# EAGLE schematic Control_Board_Schematic_v5 (EAGLE 9.7.0)
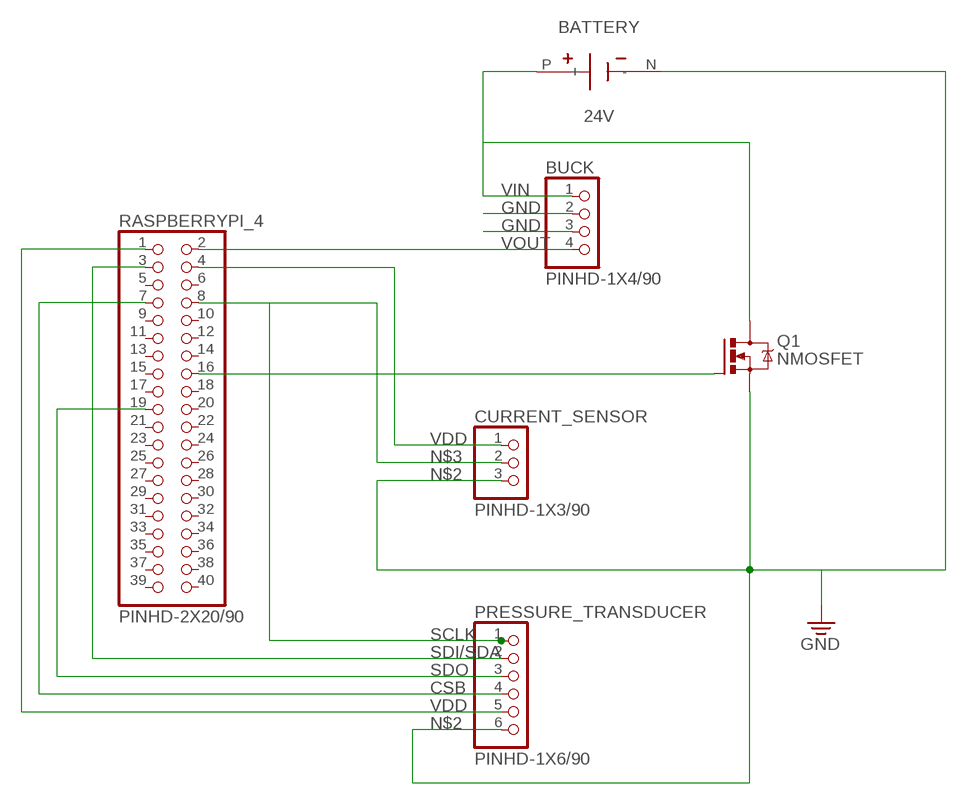
[diagram p0: schematic, sheet 1]

## Parts
BATTERY  24V  796136-1  [796136-1]
BUCK  PINHD-1X4/90  [1X04/90]
CURRENT_SENSOR  PINHD-1X3/90  [1X03/90]
PRESSURE_TRANSDUCER  PINHD-1X6/90  [1X06/90]
Q1  NMOSFET  NMOSFET_TO220  [TO220BV]
RASPBERRYPI_4  PINHD-2X20/90  [2X20/90]

## Nets
CSB: PRESSURE_TRANSDUCER.4 RASPBERRYPI_4.7
GND: BUCK.2 BUCK.3
N$1: Q1.G RASPBERRYPI_4.16
N$2: BATTERY.N(-) CURRENT_SENSOR.3 PRESSURE_TRANSDUCER.6 Q1.S
N$3: CURRENT_SENSOR.2 RASPBERRYPI_4.8
SCLK: PRESSURE_TRANSDUCER.1
SDI/SDA: PRESSURE_TRANSDUCER.2 RASPBERRYPI_4.3
SDO: PRESSURE_TRANSDUCER.3 RASPBERRYPI_4.19
VDD: CURRENT_SENSOR.1 PRESSURE_TRANSDUCER.5 RASPBERRYPI_4.1 RASPBERRYPI_4.4
VIN: BATTERY.P(+) BUCK.1 Q1.D
VOUT: BUCK.4 RASPBERRYPI_4.2
Unconnected: RASPBERRYPI_4.5 RASPBERRYPI_4.6 RASPBERRYPI_4.9 RASPBERRYPI_4.10 RASPBERRYPI_4.11 RASPBERRYPI_4.12 RASPBERRYPI_4.13 RASPBERRYPI_4.14 RASPBERRYPI_4.15 RASPBERRYPI_4.17 RASPBERRYPI_4.18 RASPBERRYPI_4.20 RASPBERRYPI_4.21 RASPBERRYPI_4.22 RASPBERRYPI_4.23 RASPBERRYPI_4.24 RASPBERRYPI_4.25 RASPBERRYPI_4.26 RASPBERRYPI_4.27 RASPBERRYPI_4.28 RASPBERRYPI_4.29 RASPBERRYPI_4.30 RASPBERRYPI_4.31 RASPBERRYPI_4.32 RASPBERRYPI_4.33 RASPBERRYPI_4.34 RASPBERRYPI_4.35 RASPBERRYPI_4.36 RASPBERRYPI_4.37 RASPBERRYPI_4.38 RASPBERRYPI_4.39 RASPBERRYPI_4.40

## Library data of the parts
BATTERY = Battery_Holder:796136-1: Battery Holder - Coin Cell SMD, 20.0mm Datasheet <https://www.te.com/commerce/DocumentDelivery/DDEController?Action=showdoc&DocId=Customer+Drawing%7F796136%7FG5%7Fpdf%7FEnglish%7FENG_CD_796136_G5.pdf%7F796136-1>; CATEGORY: Battery-Holder; MANUFACTURER: TE Connectivity AMP Connectors; MPN: 796136-1; PART_STATUS: ACTIVE; ROHS_COMPLIANCE: Compliant; SERIES: 2032; SUB_CATEGORY: Holder; TYPE: Coin Cell; VALUE: 796136-1
BUCK = Connector:PINHD-1X4: PIN HEADER; CATEGORY: CONNECTOR; SUB-CATEGORY: PIN-HEADER
CURRENT_SENSOR = Connector:PINHD-1X3: PIN HEADER; CATEGORY: CONNECTOR; SUB-CATEGORY: PIN-HEADER
PRESSURE_TRANSDUCER = Connector:PINHD-1X6: PIN HEADER; CATEGORY: CONNECTOR; SUB-CATEGORY: PIN-HEADER
Q1 = Transistor:NMOSFET: N-Channel MOSFET - Generic; CATEGORY: Transistor; SUB-CATEGORY: MOSFET; TYPE: N-Channel
RASPBERRYPI_4 = Connector:PINHD-2X20: PIN HEADER; CATEGORY: CONNECTOR; SUB-CATEGORY: PIN-HEADER